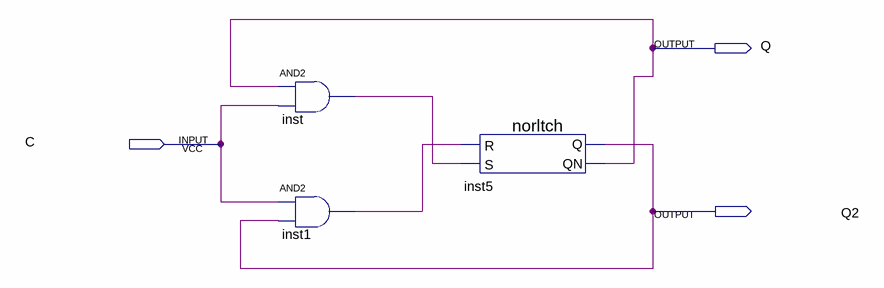
[diagram p0: schematic sheet]
// Quartus schematic temp.bdf as structural Verilog: 3 symbols, 3 pins
module temp (
  input  C,
  output Q,
  output Q2
);

  wire inst1_out, inst_out;

  and inst (inst_out, Q, C);
  and inst1 (inst1_out, C, Q2);
  norltch inst5 (.R(inst1_out), .S(inst_out), .Q(Q2), .QN(Q));
endmodule
